# EAGLE schematic High-Level PCB v3.0 - SAVE 1 (EAGLE 8.1.0)
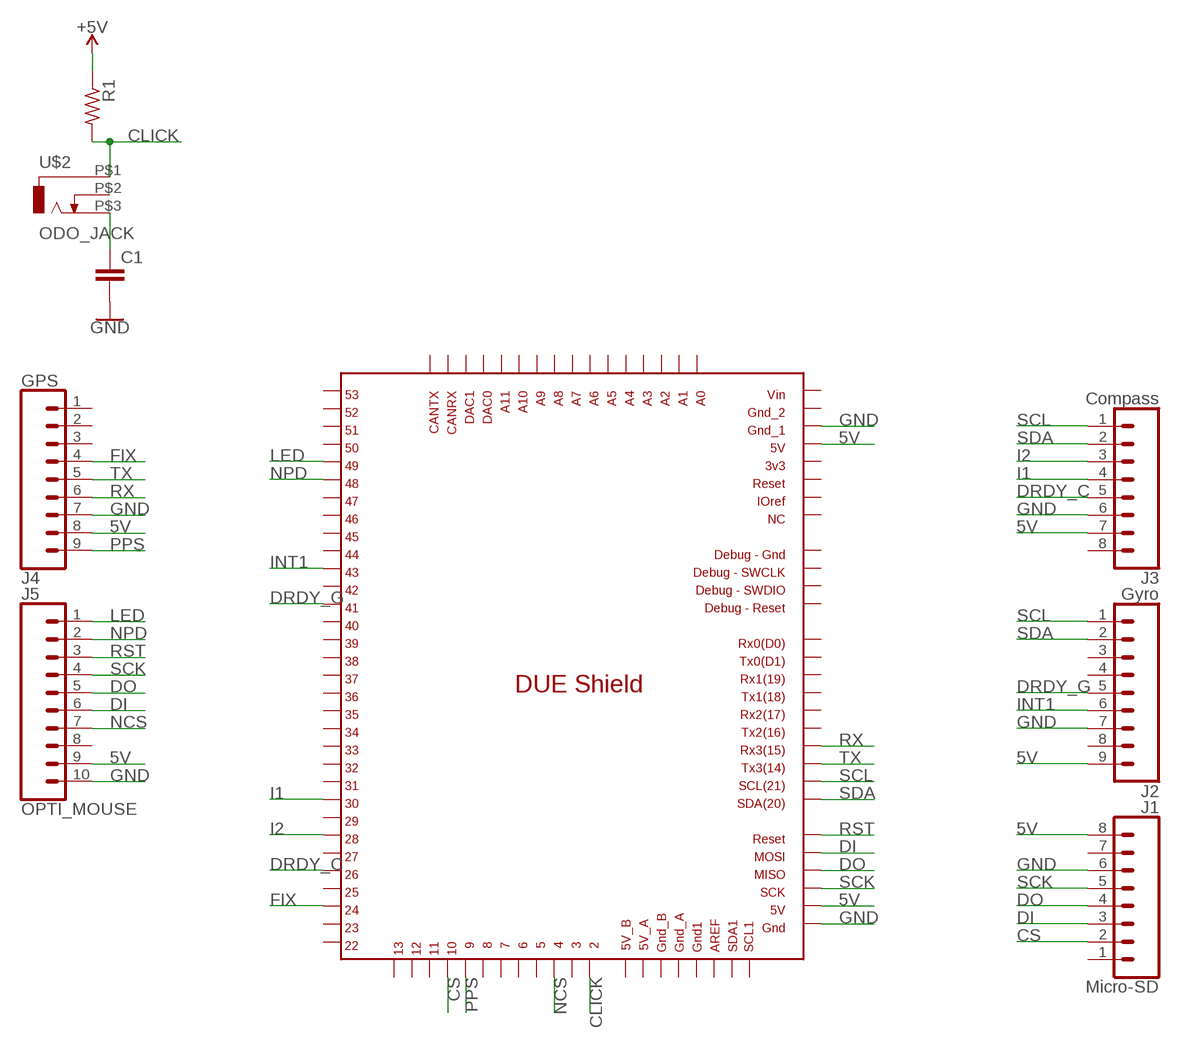
[diagram p0: schematic, sheet 1]

## Parts
C1  C2.5/5  [C2.5-5]
J1  Micro-SD  CONN_08"  [1X08]
J2  Gyro  CONN_09  [1X09]
J3  Compass  CONN_08"  [1X08]
J4  GPS  CONN_09  [1X09]
OPTI_MOUSE  J5  CONN_10"  [1X10]
R1  R-US_0204/5  [0204/5]
U$1  DUE(NORMAL)  [DUE(NORMAL)]
U$2  ODO_JACK  [ODO_JACK]

## Nets
5V: J1.8 J2.9 J3.7 J4.8 OPTI_MOUSE.9 R1.1 U$1.5V U$1.GND_ICSP ; supply symbol labelled +5V
CLICK: R1.2 U$1.2 U$2.P$1
CS: J1.2 U$1.10
DI: J1.3 OPTI_MOUSE.6 U$1.MOSI_ICSP
DO: J1.4 OPTI_MOUSE.5 U$1.MISO_ICSP
DRDY_C: J3.5 U$1.26
DRDY_G: J2.5 U$1.41
FIX: J4.4 U$1.24
GND: C1.2 J1.6 J2.7 J3.6 J4.7 OPTI_MOUSE.10 U$1.5V_ICSP U$1.GND_1
I1: J3.4 U$1.30
I2: J3.3 U$1.28
INT1: J2.6 U$1.43
LED: OPTI_MOUSE.1 U$1.49
N$1: C1.1 U$2.P$3
NCS: OPTI_MOUSE.7 U$1.4
NPD: OPTI_MOUSE.2 U$1.48
PPS: J4.9 U$1.9
RST: OPTI_MOUSE.3 U$1.RESET_ICSP
RX: J4.6 U$1.RX3
SCK: J1.5 OPTI_MOUSE.4 U$1.SCK_ICSP
SCL: J2.1 J3.1 U$1.SCL
SDA: J2.2 J3.2 U$1.SDA
TX: J4.5 U$1.TX3
Unconnected: J1.1 J1.7 J2.3 J2.4 J2.8 J3.8 J4.1 J4.2 J4.3 OPTI_MOUSE.8 U$1.3 U$1.3V3 U$1.5 U$1.5V_A U$1.5V_B U$1.6 U$1.7 U$1.8 U$1.11 U$1.12 U$1.13 U$1.22 U$1.23 U$1.25 U$1.27 U$1.29 U$1.31 U$1.32 U$1.33 U$1.34 U$1.35 U$1.36 U$1.37 U$1.38 U$1.39 U$1.40 U$1.42 U$1.44 U$1.45 U$1.46 U$1.47 U$1.50 U$1.51 U$1.52 U$1.53 U$1.A0 U$1.A1 U$1.A2 U$1.A3 U$1.A4 U$1.A5 U$1.A6 U$1.A7 U$1.A8 U$1.A9 U$1.A10 U$1.A11 U$1.AREF U$1.CANRX U$1.CANTX U$1.DAC0 U$1.DAC1 U$1.GND1 U$1.GND_2 U$1.GND_A U$1.GND_B U$1.GND_DEBUG U$1.IOREF U$1.NC U$1.RESET U$1.RESET_DEBUG U$1.RX0 U$1.RX1 U$1.RX2 U$1.SCL1 U$1.SDA1 U$1.SWCLK_DEBUG U$1.SWDIO_DEBUG U$1.TX0 U$1.TX1 U$1.TX2 U$1.VIN U$2.P$2

## Library data of the parts
C1 = capacitor-wima:C: CAPACITOR naming: grid - package width
J1 J3 = SparkFun-Connectors:CONN_08: Multi connection point. Often used as Generic Header-pin footprint for 0.1 inch spaced/style header connections On any of the 0.1 inch spaced packages, you can populate with these: Break Away Headers - Straight <https://www.sparkfun.com/products/116> (PRT-00116) Break Away Male Headers - Right Angle <https://www.sparkfun.com/products/553> (PRT-00553) Female Headers <https://www.sparkfun.com/products/115> (PRT-00115) Break Away Headers - Machine Pin <https://www.sparkfun.com/products/117> (PRT-00117) Break Away Female Headers - Swiss Machine Pin <https://www.sparkfun.com/products/743> (PRT-00743) Arduino Stackable Header - 8 Pin <https://www.sparkfun.com/products/9279> (PRT-09279) For SCREWTERMINALS and SPRING TERMINALS visit here: Screw Terimnals on SparkFun.com <https://www.sparkfun.com/search/results?term=Screw+Terminals> (5mm/3.5mm/2.54mm spacing) This device is also useful as a general connection point to wire up your design to another part of your project. Our various solder wires solder well into these plated through hole pads. Hook-Up Wire - Assortment (Stranded, 22 AWG) <https://www.sparkfun.com/products/11375> (PRT-11375) Hook-Up Wire - Assortment (Solid Core, 22 AWG) <https://www.sparkfun.com/products/11367> (PRT-11367) View the entire wire category on our website here <https://www.sparkfun.com/categories/141> Special notes: Molex polarized connector foot print use with SKU : PRT-08231 with associated crimp pins and housings. 1MM SMD Version SKU: PRT-10208 NOTES ON THE VARIANTS LOCK and LOCK_LONGPADS... This footprint was designed to help hold the alignment of a through-hole component (i.e. 6-pin header) while soldering it into place. You may notice that each hole has been shifted either up or down by 0.005 of an inch from it's more standard position (which is a perfectly straight line). This slight alteration caused the pins (the squares in the middle) to touch the edges of the holes. Because they are alternating, it causes a "brace" to hold the component in place. 0.005 has proven to be the perfect amount of "off-center" position when using our standard breakaway headers. Although looks a little odd when you look at the bare footprint, once you have a header in there, the alteration is very hard to notice. Also,if you push a header all the way into place, it is covered up entirely on the bottom side.; PROD_ID: CONN-08438
J2 J4 = SparkFun-Connectors:CONN_09: Multi connection point. Often used as Generic Header-pin footprint for 0.1 inch spaced/style header connections On any of the 0.1 inch spaced packages, you can populate with these: Break Away Headers - Straight <https://www.sparkfun.com/products/116> (PRT-00116) Break Away Male Headers - Right Angle <https://www.sparkfun.com/products/553> (PRT-00553) Female Headers <https://www.sparkfun.com/products/115> (PRT-00115) Break Away Headers - Machine Pin <https://www.sparkfun.com/products/117> (PRT-00117) Break Away Female Headers - Swiss Machine Pin <https://www.sparkfun.com/products/743> (PRT-00743) For SCREWTERMINALS and SPRING TERMINALS visit here: Screw Terimnals on SparkFun.com <https://www.sparkfun.com/search/results?term=Screw+Terminals> (5mm/3.5mm/2.54mm spacing) This device is also useful as a general connection point to wire up your design to another part of your project. Our various solder wires solder well into these plated through hole pads. Hook-Up Wire - Assortment (Stranded, 22 AWG) <https://www.sparkfun.com/products/11375> (PRT-11375) Hook-Up Wire - Assortment (Solid Core, 22 AWG) <https://www.sparkfun.com/products/11367> (PRT-11367) View the entire wire category on our website here <https://www.sparkfun.com/categories/141> Special notes: Molex polarized connector foot print use with SKU : PRT-08231 with associated crimp pins and housings. 1MM SMD Version SKU: PRT-10208 NOTES ON THE VARIANTS LOCK and LOCK_LONGPADS... This footprint was designed to help hold the alignment of a through-hole component (i.e. 6-pin header) while soldering it into place. You may notice that each hole has been shifted either up or down by 0.005 of an inch from it's more standard position (which is a perfectly straight line). This slight alteration caused the pins (the squares in the middle) to touch the edges of the holes. Because they are alternating, it causes a "brace" to hold the component in place. 0.005 has proven to be the perfect amount of "off-center" position when using our standard breakaway headers. Although looks a little odd when you look at the bare footprint, once you have a header in there, the alteration is very hard to notice. Also,if you push a header all the way into place, it is covered up entirely on the bottom side.
OPTI_MOUSE = SparkFun-Connectors:CONN_10: Multi connection point. Often used as Generic Header-pin footprint for 0.1 inch spaced/style header connections On any of the 0.1 inch spaced packages, you can populate with these: Break Away Headers - Straight <https://www.sparkfun.com/products/116> (PRT-00116) Break Away Male Headers - Right Angle <https://www.sparkfun.com/products/553> (PRT-00553) Female Headers <https://www.sparkfun.com/products/115> (PRT-00115) Break Away Headers - Machine Pin <https://www.sparkfun.com/products/117> (PRT-00117) Break Away Female Headers - Swiss Machine Pin <https://www.sparkfun.com/products/743> (PRT-00743) Arduino Stackable Header - 10 Pin <https://www.sparkfun.com/products/11376> (PRT-11376) For SCREWTERMINALS and SPRING TERMINALS visit here: Screw Terimnals on SparkFun.com <https://www.sparkfun.com/search/results?term=Screw+Terminals> (5mm/3.5mm/2.54mm spacing) This device is also useful as a general connection point to wire up your design to another part of your project. Our various solder wires solder well into these plated through hole pads. Hook-Up Wire - Assortment (Stranded, 22 AWG) <https://www.sparkfun.com/products/11375> (PRT-11375) Hook-Up Wire - Assortment (Solid Core, 22 AWG) <https://www.sparkfun.com/products/11367> (PRT-11367) View the entire wire category on our website here <https://www.sparkfun.com/categories/141> Special notes: Molex polarized connector foot print use with SKU : PRT-08231 with associated crimp pins and housings. 1MM SMD Version SKU: PRT-10208 NOTES ON THE VARIANTS LOCK and LOCK_LONGPADS... This footprint was designed to help hold the alignment of a through-hole component (i.e. 6-pin header) while soldering it into place. You may notice that each hole has been shifted either up or down by 0.005 of an inch from it's more standard position (which is a perfectly straight line). This slight alteration caused the pins (the squares in the middle) to touch the edges of the holes. Because they are alternating, it causes a "brace" to hold the component in place. 0.005 has proven to be the perfect amount of "off-center" position when using our standard breakaway headers. Although looks a little odd when you look at the bare footprint, once you have a header in there, the alteration is very hard to notice. Also,if you push a header all the way into place, it is covered up entirely on the bottom side.; PROD_ID: CONN-11563
R1 = resistor:R-US_: RESISTOR, American symbol
U$1 = DUElib130425:DUE(NORMAL)
U$2 = elcanoParts:ODO_JACK